# EAGLE design AST1024 (EAGLE 6.3)
DATABASE: ./../../../../../Components/TinyCircuits_Part_Database.txt
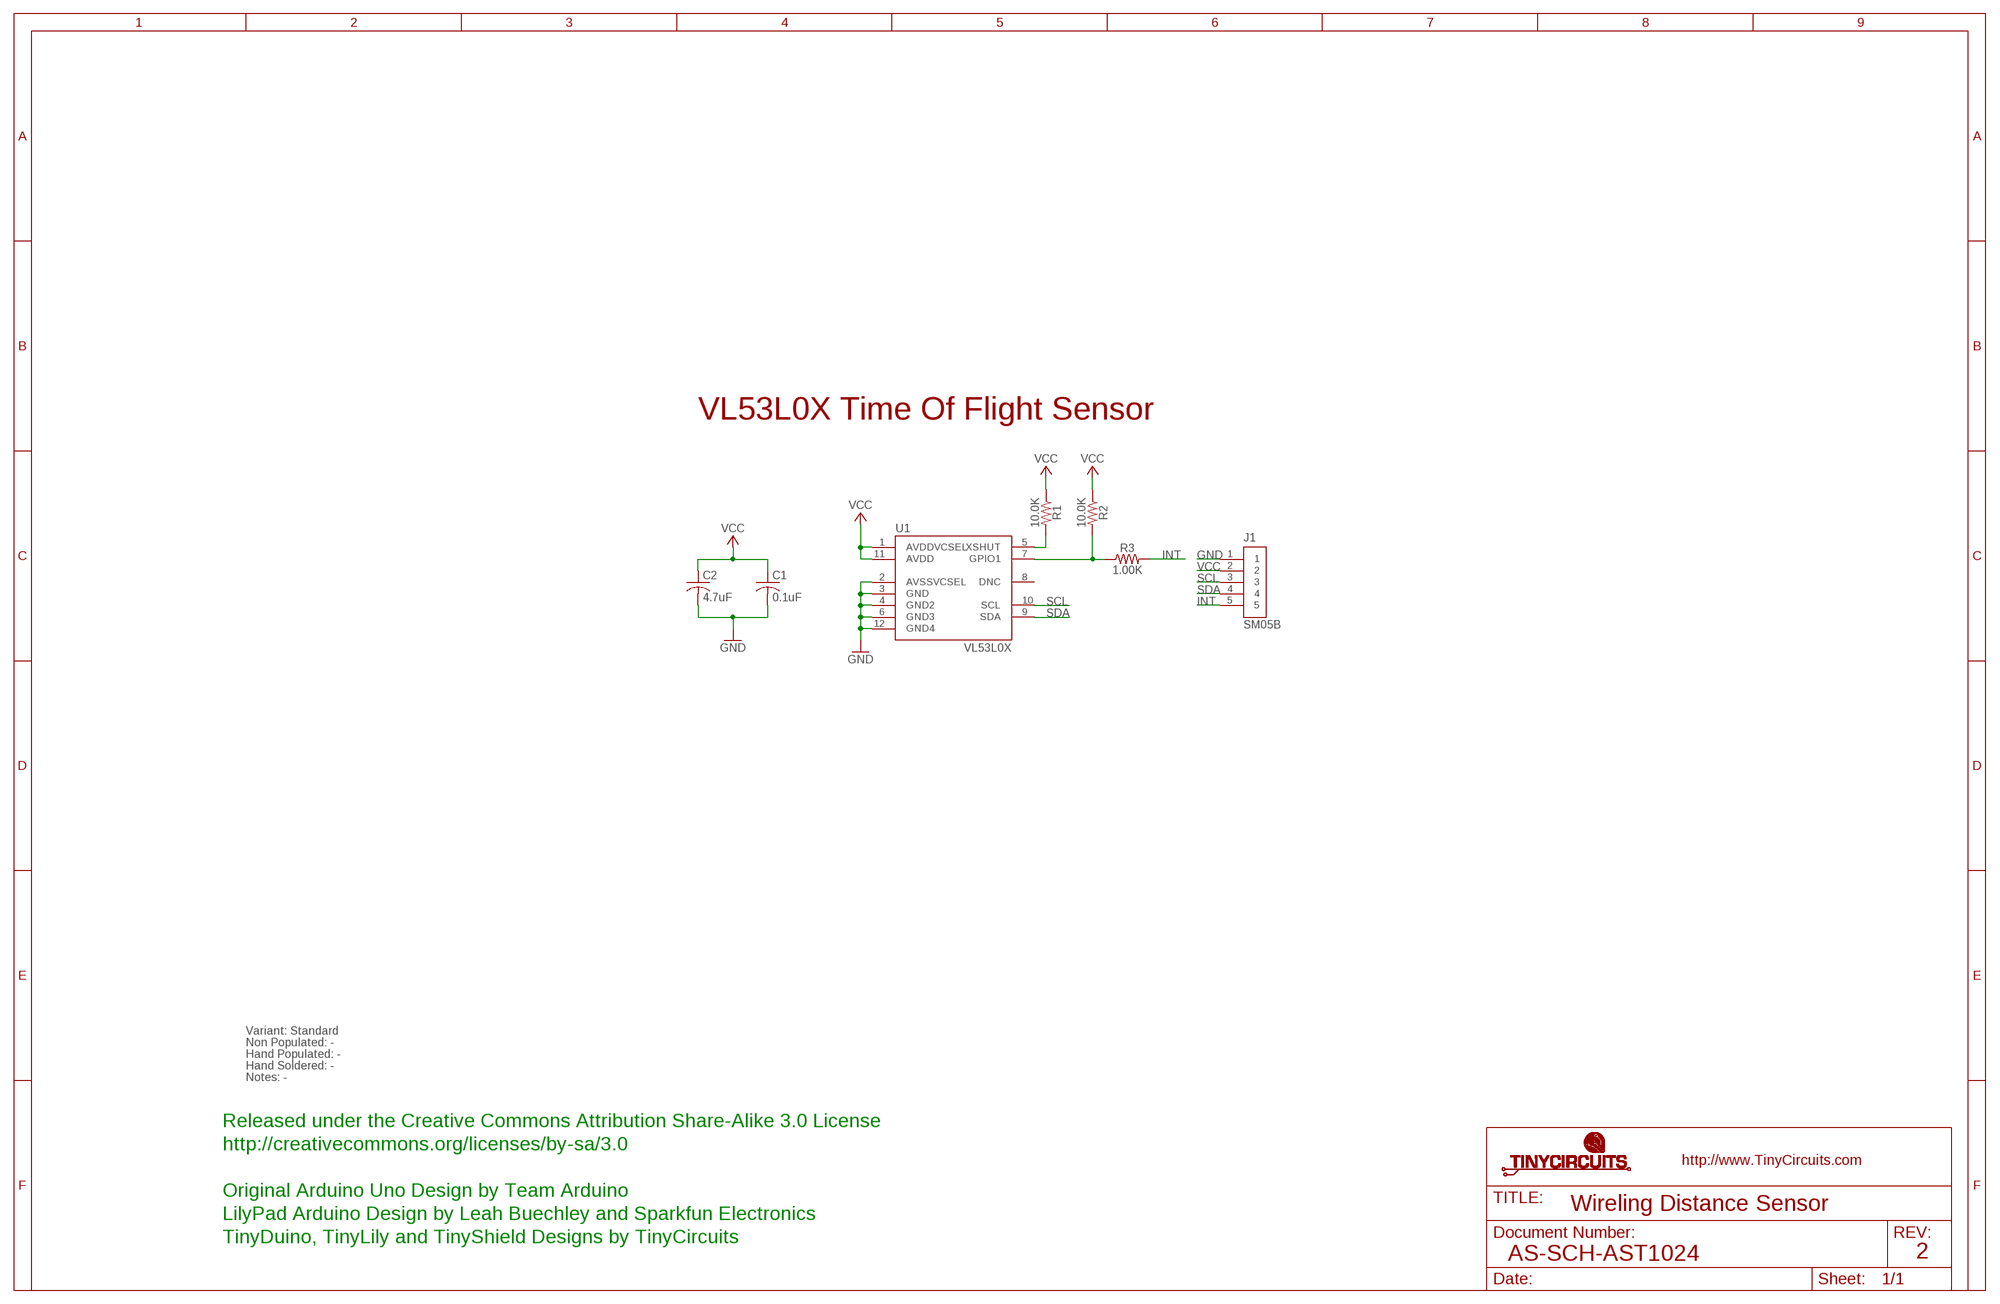
[diagram p0: schematic, sheet 1]

## Parts
C1  0.1uF  AS-ITM-00008  [C0402]
C2  4.7uF  AS-ITM-00088  [C0603]
J1  SM05B  AS-ITM-00340EDGE  [JST_SH_5X1_EDGE]
R1  10.0K  AS-ITM-00032  [0402]
R2  10.0K  AS-ITM-00032  [0402]
R3  1.00K  AS-ITM-00003  [0402]
U1  VL53L0X  AS-ITM-00338  [VL53L0X]

## Nets
GND: C1.2 C2.2 J1.1 U1.2(AVSSVCSEL) U1.3(GND) U1.4(GND2) U1.6(GND3) U1.12(GND4)
GPIO1: R2.2 R3.1 U1.7(GPIO1)
INT: J1.5 R3.2
N$1: R1.2 U1.5(XSHUT)
SCL: J1.3 U1.10(SCL)
SDA: J1.4 U1.9(SDA)
VCC: C1.1 C2.1 J1.2 R1.1 R2.1 U1.1(AVDDVCSEL) U1.11(AVDD)
Unconnected: U1.8(DNC)

## Notes on the sheet
- VL53L0X Time Of Flight Sensor
- Variant: Standard
- Non Populated: -
- Hand Populated: -
- Hand Soldered: -
- Notes: -
- Released under the Creative Commons Attribution Share-Alike 3.0 License
- http://creativecommons.org/licenses/by-sa/3.0
- Original Arduino Uno Design by Team Arduino
- Wireling Distance Sensor
- LilyPad Arduino Design by Leah Buechley and Sparkfun Electronics
- TinyDuino, TinyLily and TinyShield Designs by TinyCircuits
- AS-SCH-AST1024 | 2

## Library data of the parts
C1 = tinycircuits:AS-ITM-00008: CAP CER 0.1UF 16V 10% X5R 0402; PARTNO: AS-ITM-00008
C2 = tinycircuits:AS-ITM-00088: CAP CER 4.7UF 6.3V 20% X5R 0603; PARTNO: AS-ITM-00088
J1 = tinycircuits:AS-ITM-00340: CONN HEADER SH 5POS SIDE 1MM TIN; PARTNO: AS-ITM-00340; PNPROTATION: 180
R1 R2 = tinycircuits:AS-ITM-00032: RES 10.0K OHM 1/16W 1% 0402 SMD; PARTNO: AS-ITM-00032
R3 = tinycircuits:AS-ITM-00003: RES 1.00K OHM 1/16W 1% 0402; PARTNO: AS-ITM-00003
U1 = tinycircuits:AS-ITM-00338: SENSOR LASER DISTANCE TOF 2M; PARTNO: AS-ITM-00338

## Net classes
2 gnd: width 0.305 mm, drill 0.559 mm, clearance 0.254 mm

## Board
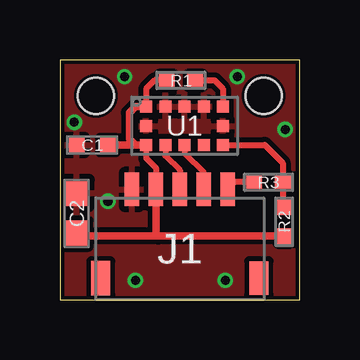
[diagram p1: board, top side]
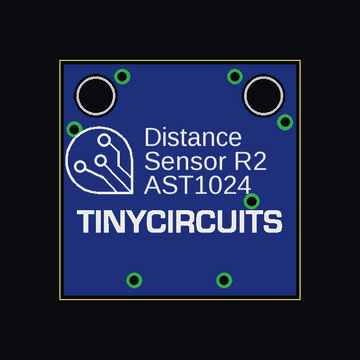
[diagram p2: board, bottom side, seen from below]

Size 10 x 10 mm. Coordinates in mm from the lower left corner, seen from the top.
Outline: 0,0 10,0 10,10 0,10 0,0
Copper layers (1*16): Top 0.035mm / dielectric 1.5mm / Bottom 0.035mm
Design rules "default *": minimum track width 8mil, minimum drill 15mil, track to track 8mil, track to pad 8mil, pad to pad 8mil, via to via 8mil, smd to smd 8mil, copper to edge 6mil, drill to drill 8mil, minimum pad ring 8mil, minimum via ring 5mil, stop-mask expansion 4mil, vias tented up to drill 25mil, thermal gap 10mil
Holes 1.5 mm at 1.5,8.5 8.5,8.5

### Footprints (pad centres in the part's own frame; a part is rotated, then mirrored left to right if it is on the bottom)
C0402 = smd 0.65 x 0.6: 1 -0.65,0; 2 0.65,0
C0603 = smd 1.1 x 1: 1 -0.85,0; 2 0.85,0
JST_SH_5X1_EDGE = smd 0.6 x 1.4: 1 -2,2.475; 2 -1,2.475; 3 0,2.475; 4 1,2.475; 5 2,2.475 | smd 0.8 x 1.4: PAD1 -3.3,-1.225; PAD2 3.3,-1.225
0402 = smd 0.65 x 0.55: 1 -0.6,0; 2 0.6,0
VL53L0X = smd 0.5 x 0.5: 1 1.6,-0.8; 2 0.8,-0.8; 3 0,-0.8; 4 -0.8,-0.8; 5 -1.6,-0.8; 6 -1.6,0; 7 -1.6,0.8; 8 -0.8,0.8; 9 0,0.8; 10 0.8,0.8; 11 1.6,0.8; 12 1.6,0

### Placement (x,y rotation side)
C1  1.35,6.45 180 top
C2  0.7,3.6 90 top
J1  5,2.12 0 top
R1  5.05,9.15 0 top
R2  9.35,3.25 90 top
R3  8.7,4.9 180 top
U1  5.2,7.25 180 top
U$1  [DOCFIELD-TINYCIRCUITS-PCB]  19,-10 0 top  (outside the outline)

### Tracks (layer width: path | path; a pad name or v marks a point on that pad's centre or on a via)
GND  (via drill 0.38)
  other vias: 6.9,0.8 7.4,9.3 3.15,0.8 2.7,9.3 0.6,7.4 2,4.1 9.4,7.1
  pour Bottom: 0,10 10,10 10,0 0,0
  pour Top: 0,10 10,10 10,0 0,0
GPIO1
  Top 0.254: R2.2 9.3,3.8 R3.1 9.3,5.7 8.55,6.45 U1.7
INT
  Top 0.254: R3.2 7.3,4.9 J1.5
N$1
  Top 0.254: R1.2 6.45,9.15 6.8,8.8 U1.5
SCL
  Top 0.254: U1.10 4.4,6 5,5.4 J1.3
SDA
  Top 0.254: U1.9 5.2,6.1 6,5.3 J1.4
VCC
  Top 0.254: R1.1 3.95,9.15 3.6,8.8 U1.1 | U1.11 3.6,5.9 4,5.5 J1.2
  Top 0.305: U1.1 3.15,8.05 2.9,7.8 2.9,6.7 3.15,6.45 | C1.1 3.15,6.45 | 3.15,6.45 U1.11 | R2.1 4.1,2.65 | 4.1,2.65 0.8,2.65 C2.1 | J1.2 4,2.75 4.1,2.65

### Text on the board
bPlace: Distance | Sensor R2 | AST1024
Document: FABRICATION DRAWING | NOTES: | 1. PRINTED CIRCUIT BOARD MADE FROM NEMA GRADE FR-4 EPOXY LAMINATE | WITH 1 OUNCE COPPER PLATING AND .024 THICKNESS. | 2. ALL DIMENSIONS ARE GIVEN IN MILLIMETERS. | 3. CIRCUIT PATHS ARE FOR REFERENCE ONLY. | 4. HOLE SIZES SHOWN ARE FINISHED DIAMETERS AFTER PLATING. | 5. BOARD PLATED USING REFLOW OR SIMILAR METHOD. | 6. BOARD TO HAVE BLUE SOLDER MASK ON PLATED SURFACES USING WET FILM | 7. SILKSCREEN BOARD USING WHITE INK. | SR100 OR SR1010 EPOXY. EQUIVALENT WET OR DRY FILM MAY BE USED. | 8. THE FOLLOWING INFORMATION APPLIES TO THIS BOARD: | * 2 COPPER LAYERS | * .024 BOARD THICKNESS | * REQUIRES TOP SIDE SILKSCREEN | Released under the Creative Commons Attribution Share-Alike 3.0 License | http://creativecommons.org/licenses/by-sa/3.0 | Original Arduino Uno Design by Team Arduino | LilyPad Arduino Design by Leah Buechley and Sparkfun Electronics | TinyDuino, TinyLily and TinyShield Designs by TinyCircuits | Wireling Distance Sensor | AS-PCB-AST1024 | 2